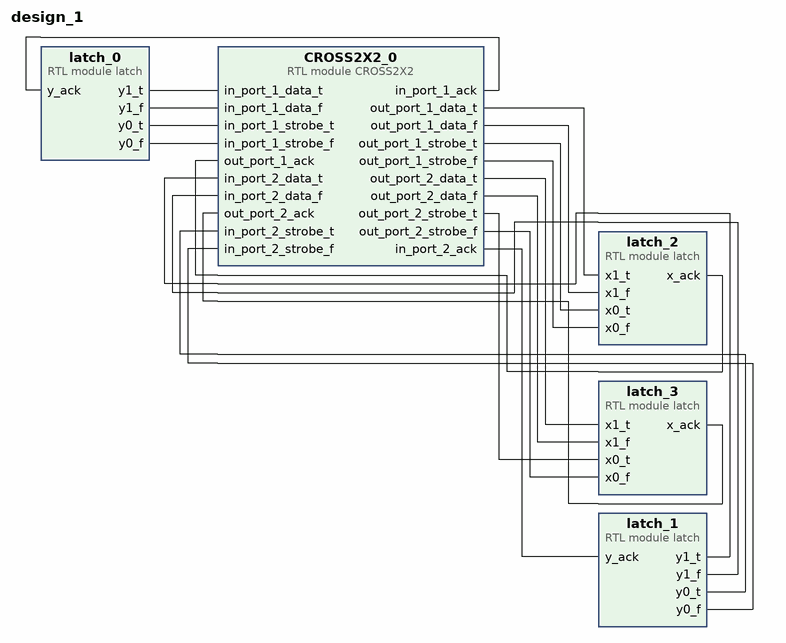
[diagram p0: block diagram of the top level]
# Vivado block design design_1, xc7a35tcpg236-1, Vivado 2019.2
create_bd_design design_1

create_bd_cell -type module -reference CROSS2X2 CROSS2X2_0
create_bd_cell -type module -reference latch latch_0
create_bd_cell -type module -reference latch latch_1
create_bd_cell -type module -reference latch latch_2
create_bd_cell -type module -reference latch latch_3

# ---- connections ----

connect_bd_net [get_bd_pins latch_0/y1_t] [get_bd_pins CROSS2X2_0/in_port_1_data_t]
connect_bd_net [get_bd_pins latch_0/y1_f] [get_bd_pins CROSS2X2_0/in_port_1_data_f]
connect_bd_net [get_bd_pins latch_0/y0_t] [get_bd_pins CROSS2X2_0/in_port_1_strobe_t]
connect_bd_net [get_bd_pins latch_0/y0_f] [get_bd_pins CROSS2X2_0/in_port_1_strobe_f]
connect_bd_net [get_bd_pins CROSS2X2_0/in_port_1_ack] [get_bd_pins latch_0/y_ack]
connect_bd_net [get_bd_pins latch_1/y1_t] [get_bd_pins CROSS2X2_0/in_port_2_data_t]
connect_bd_net [get_bd_pins latch_1/y1_f] [get_bd_pins CROSS2X2_0/in_port_2_data_f]
connect_bd_net [get_bd_pins latch_1/y0_t] [get_bd_pins CROSS2X2_0/in_port_2_strobe_t]
connect_bd_net [get_bd_pins latch_1/y0_f] [get_bd_pins CROSS2X2_0/in_port_2_strobe_f]
connect_bd_net [get_bd_pins CROSS2X2_0/in_port_2_ack] [get_bd_pins latch_1/y_ack]
connect_bd_net [get_bd_pins CROSS2X2_0/out_port_1_data_t] [get_bd_pins latch_2/x1_t]
connect_bd_net [get_bd_pins CROSS2X2_0/out_port_1_data_f] [get_bd_pins latch_2/x1_f]
connect_bd_net [get_bd_pins CROSS2X2_0/out_port_1_strobe_t] [get_bd_pins latch_2/x0_t]
connect_bd_net [get_bd_pins CROSS2X2_0/out_port_1_strobe_f] [get_bd_pins latch_2/x0_f]
connect_bd_net [get_bd_pins latch_2/x_ack] [get_bd_pins CROSS2X2_0/out_port_1_ack]
connect_bd_net [get_bd_pins CROSS2X2_0/out_port_2_data_t] [get_bd_pins latch_3/x1_t]
connect_bd_net [get_bd_pins CROSS2X2_0/out_port_2_data_f] [get_bd_pins latch_3/x1_f]
connect_bd_net [get_bd_pins CROSS2X2_0/out_port_2_strobe_t] [get_bd_pins latch_3/x0_t]
connect_bd_net [get_bd_pins CROSS2X2_0/out_port_2_strobe_f] [get_bd_pins latch_3/x0_f]
connect_bd_net [get_bd_pins latch_3/x_ack] [get_bd_pins CROSS2X2_0/out_port_2_ack]

validate_bd_design
save_bd_design
